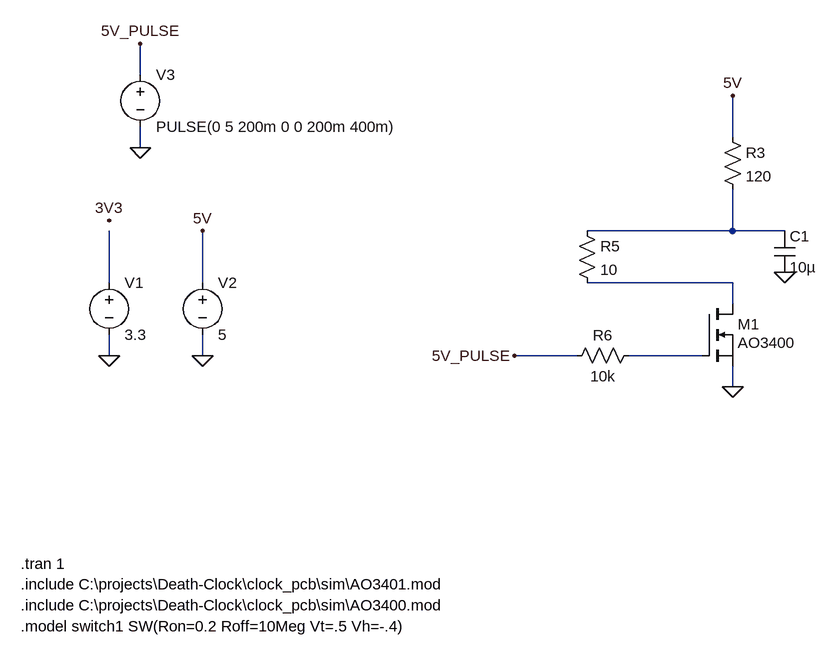
[diagram p0: schematic buzzer.asc]
buzzer.asc, the LTspice schematic file:
Version 4
SHEET 1 1272 688
WIRE -496 -176 -496 -224
WIRE 416 -80 416 -144
WIRE -496 -64 -496 -96
WIRE 416 64 416 0
WIRE 416 64 192 64
WIRE 496 64 416 64
WIRE -544 144 -544 64
WIRE -400 144 -400 64
WIRE 416 144 192 144
WIRE 416 176 416 144
WIRE -544 256 -544 224
WIRE -400 256 -400 224
WIRE 176 256 80 256
WIRE 368 256 256 256
WIRE 416 304 416 272
FLAG -544 48 3V3
FLAG -400 256 0
FLAG -400 64 5V
FLAG -496 -224 5V_PULSE
FLAG -496 -64 0
FLAG -544 256 0
FLAG 416 -144 5V
FLAG 416 304 0
FLAG 80 256 5V_PULSE
FLAG 496 128 0
SYMBOL voltage -544 128 R0
WINDOW 123 0 0 Left 0
WINDOW 39 0 0 Left 0
SYMATTR InstName V1
SYMATTR Value 3.3
SYMBOL voltage -400 128 R0
WINDOW 123 0 0 Left 0
WINDOW 39 0 0 Left 0
SYMATTR InstName V2
SYMATTR Value 5
SYMBOL voltage -496 -192 R0
WINDOW 123 0 0 Left 0
WINDOW 39 0 0 Left 0
SYMATTR InstName V3
SYMATTR Value PULSE(0 5 200m 0 0 200m 400m)
SYMBOL nmos 368 176 R0
WINDOW 3 56 72 Invisible 2
WINDOW 38 56 60 Left 2
SYMATTR Value ""
SYMATTR SpiceModel AO3400
SYMATTR InstName M1
SYMATTR Prefix X
SYMBOL res 400 -96 R0
SYMATTR InstName R3
SYMATTR Value 120
SYMBOL res 176 48 R0
SYMATTR InstName R5
SYMATTR Value 10
SYMBOL res 272 240 R90
WINDOW 0 0 56 VBottom 2
WINDOW 3 32 56 VTop 2
SYMATTR InstName R6
SYMATTR Value 10k
SYMBOL cap 480 64 R0
SYMATTR InstName C1
SYMATTR Value 10µ
TEXT -680 608 Left 2 !.include C:\\projects\\Death-Clock\\clock_pcb\\sim\\AO3401.mod
TEXT -680 576 Left 2 !.tran 1
TEXT -680 640 Left 2 !.include C:\\projects\\Death-Clock\\clock_pcb\\sim\\AO3400.mod
TEXT -680 672 Left 2 !.model switch1 SW(Ron=0.2 Roff=10Meg Vt=.5 Vh=-.4)

The netlist it stands for:
* buzzer.asc
V1 N002 0 3.3
V2 5V 0 5
V3 5V_PULSE 0 PULSE(0 5 200m 0 0 200m 400m)
XM1 N003 N004 0 AO3400  ; pins D G S
R3 5V N001 120
R5 N001 N003 10
R6 N004 5V_PULSE 10k
C1 N001 0 10µ
.include C:\projects\Death-Clock\clock_pcb\sim\AO3401.mod
.tran 1
.include C:\projects\Death-Clock\clock_pcb\sim\AO3400.mod
.model switch1 SW(Ron=0.2 Roff=10Meg Vt=.5 Vh=-.4)
.backanno
.end